# Altium schematic sheet CON_MINI_USBB_RA_KME04-USBMU03A01-1.SchDoc: USB 2.0 Type B Connector
size A4; Organization: Altium Limited.; Address1: Level 3, 12a Rodborough Rd; Address2: Frenchs Forest 2086; Address3: NSW; Address4: AUSTRALIA; DocumentNumber: 64; SheetNumber: 65; SheetTotal: 77
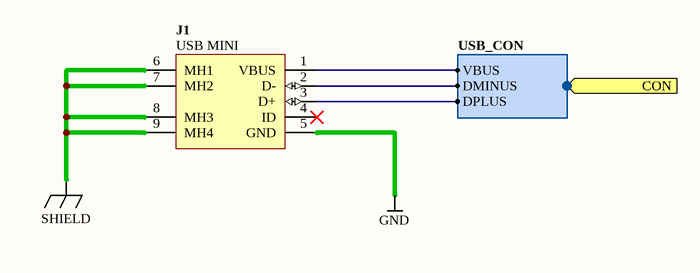
[diagram p0: CON_MINI_USBB_RA_KME04-USBMU03A01-1.SchDoc]

## Parts
J1  USB MINI  [USB-MOLEX-675031020]

## Ports
CON (harness USB_CON)

## Harnesses
USB_CON: VBUS, DMINUS, DPLUS

## Nets
GND: J1.5(GND)
SHIELD: J1.6(MH1) J1.7(MH2) J1.8(MH3) J1.9(MH4)
NetJ1_1: J1.1(VBUS) ; port CON.VBUS
NetJ1_2: J1.2(D-) ; port CON.DMINUS
NetJ1_3: J1.3(D+) ; port CON.DPLUS

Not connected (* = marked no-connect by the designer): J1 4(ID)*

## Notes on the sheet
- Sheet Title
- Project Title
- Size:
- Date:
- A4
- Assy:
- Time:
- Revision:
- Sheet
- of
- File:

## Library data of the parts
J1 = D-300-0009: USB, MINI, SMD,  Molex; Connector type: Right Angle; Max Current: mA; Category: Connector; Mounting Technology: Surface Mount; Status: Production